# Altium schematic sheet lan_board.SchDoc
size A4
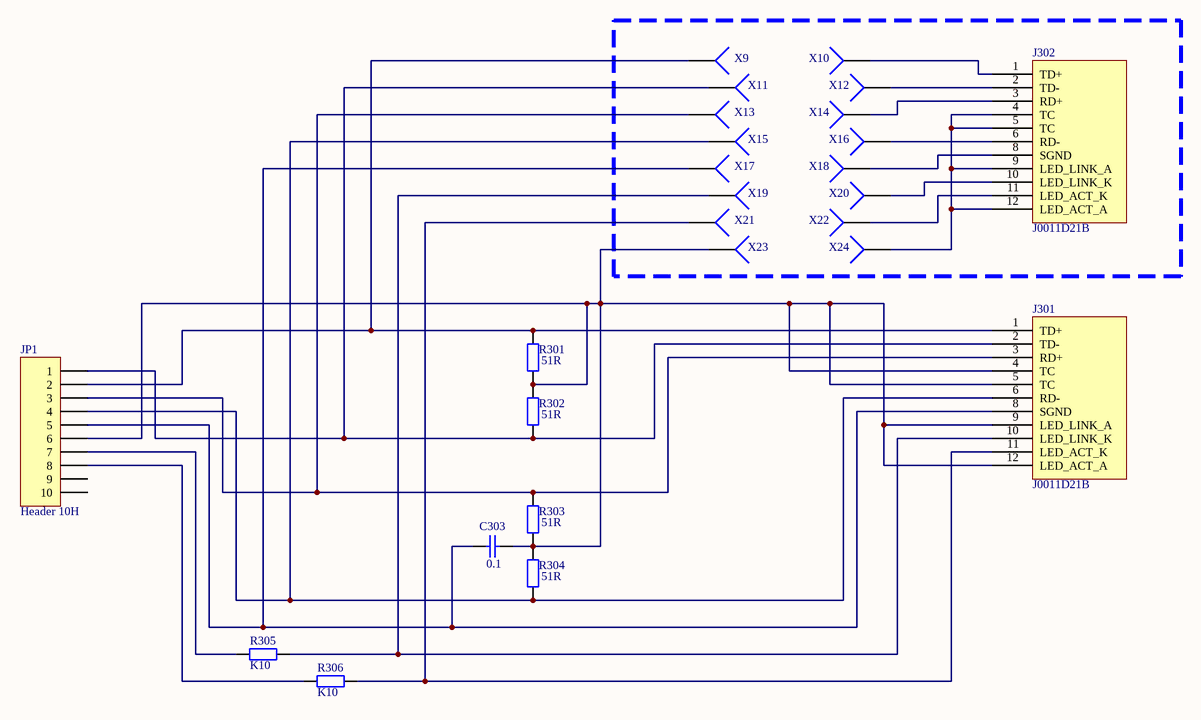
[diagram p0: lan_board.SchDoc]

## Parts
C303  0.1  [_0603]
J301  J0011D21B  [J0011D21B]
J302  J0011D21B  [J0011D21B]
JP1  Header 10H  [HDR2X5]
R301  51R  [_0603]
R302  51R  [_0603]
R303  51R  [_0603]
R304  51R  [_0603]
R305  K10  [_0603]
R306  K10  [_0603]
X9  (no value)  [PIN1]
X10  (no value)  [PIN1]
X11  (no value)  [PIN1]
X12  (no value)  [PIN1]
X13  (no value)  [PIN1]
X14  (no value)  [PIN1]
X15  (no value)  [PIN1]
X16  (no value)  [PIN1]
X17  (no value)  [PIN1]
X18  (no value)  [PIN1]
X19  (no value)  [PIN1]
X20  (no value)  [PIN1]
X21  (no value)  [PIN1]
X22  (no value)  [PIN1]
X23  (no value)  [PIN1]
X24  (no value)  [PIN1]

## Nets
NetC303_1: C303.1 J301.8(SGND) JP1.5 X17.1
NetC303_2: C303.2 J301.4(TC) J301.5(TC) J301.9(LED_LINK_A) J301.12(LED_ACT_A) JP1.6 R301.2 R302.1 R303.2 R304.1 X23.1
NetJ301_1: J301.1(TD+) JP1.2 R301.1 X9.1
NetJ301_2: J301.2(TD-) JP1.1 R302.2 X11.1
NetJ301_3: J301.3(RD+) JP1.3 R303.1 X13.1
NetJ301_6: J301.6(RD-) JP1.4 R304.2 X15.1
NetJ301_10: J301.10(LED_LINK_K) R305.1 X19.1
NetJ301_11: J301.11(LED_ACT_K) R306.1 X21.1
NetJ302_1: J302.1(TD+) X10.1
NetJ302_2: J302.2(TD-) X12.1
NetJ302_3: J302.3(RD+) X14.1
NetJ302_4: J302.4(TC) J302.5(TC) J302.9(LED_LINK_A) J302.12(LED_ACT_A) X24.1
NetJ302_6: J302.6(RD-) X16.1
NetJ302_8: J302.8(SGND) X18.1
NetJ302_10: J302.10(LED_LINK_K) X20.1
NetJ302_11: J302.11(LED_ACT_K) X22.1
NetJP1_7: JP1.7 R305.2
NetJP1_8: JP1.8 R306.2

Not connected (* = marked no-connect by the designer): JP1 9 10

## Library data of the parts
C303 = Cap Semi: Capacitor (Semiconductor SIM Model); Manufacturer: Generic Components; Class I: Passive; Value: 1,0; Published: 8-Jun-2000; Revision: July-2002: Re-released for DXP Platform.; Publisher: Altium Limited; Class II: Capacitor
JP1 = Header 10H: Header, 10-Pin, Right Angle; Manufacturer: Generic Components; Class I: Connector; Revision: July-2002: Re-released for DXP Platform.; Publisher: Altium Limited
R301-R306 = Res2: Resistor; Manufacturer: Generic Components; Class I: Passive; Value: 30; Rule: Undefined; Published: 8-Jun-2000; Revision: July-2002: Re-released for DXP Platform.; Publisher: Altium Limited; Class II: Resistor
X9-X24 = Socket: Manufacturer: Generic Components; Class I: Connector; Revision: July-2002: Re-released for DXP Platform.; Publisher: Altium Limited